# Altium project RT2 - DUT Single Channel for VNA.PrjPcb
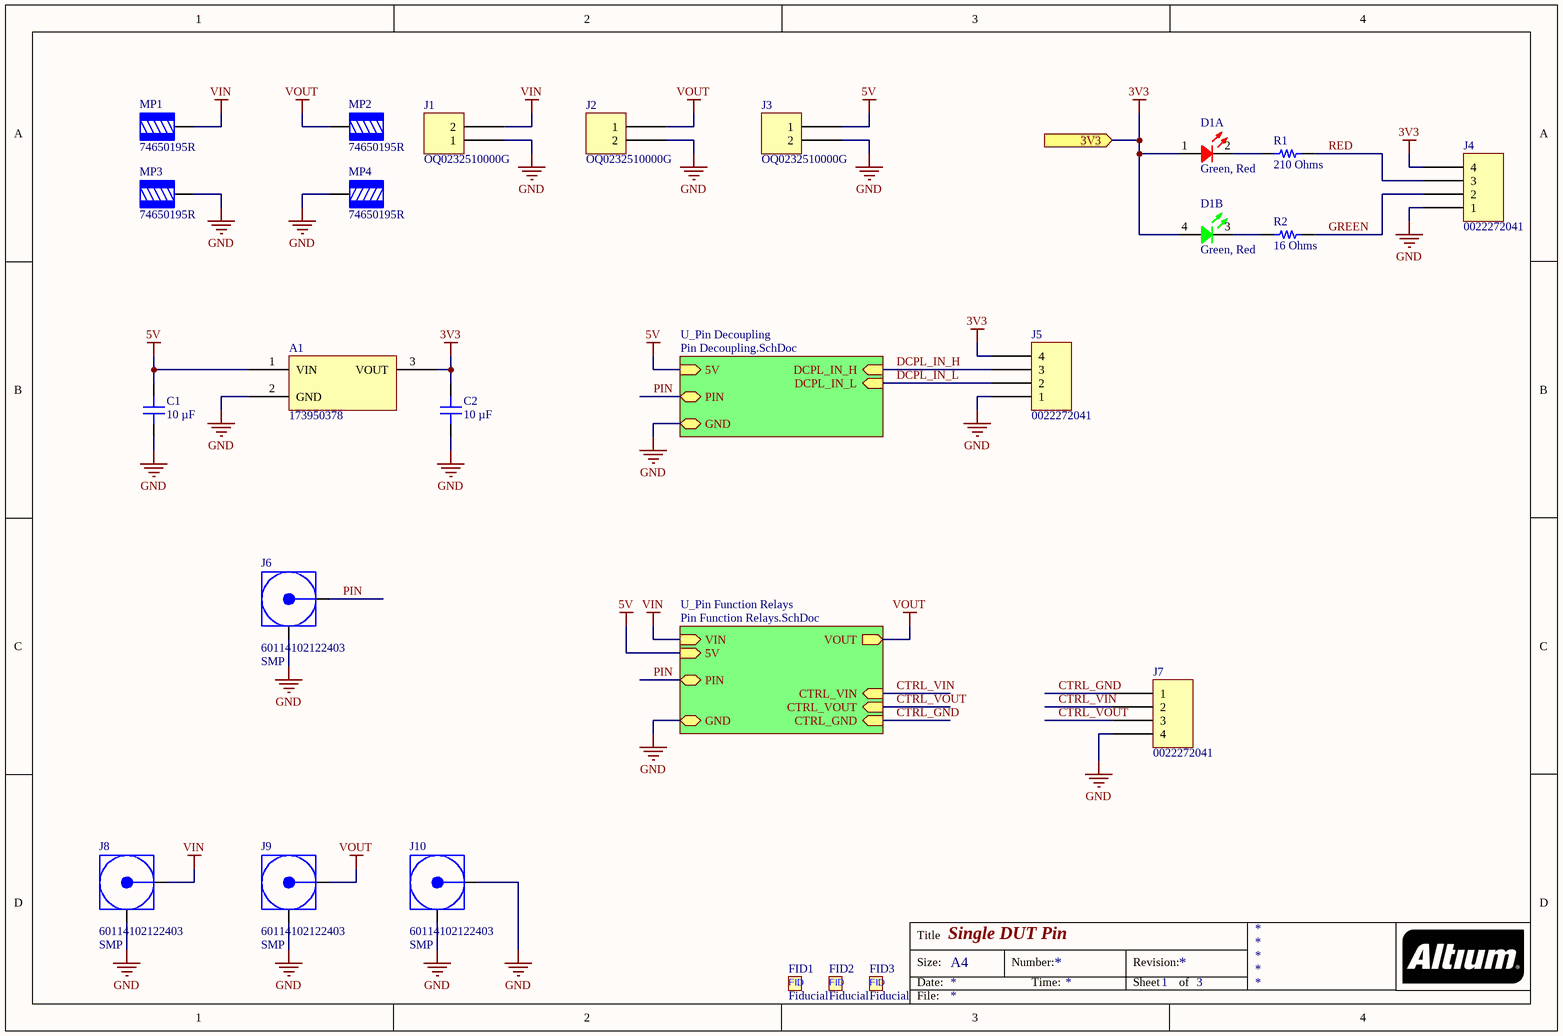
[diagram p0: DUT Pin.SchDoc]
3 sheets, 59 parts. Net scope: hierarchical (ports join the sheet entries above them; power ports are global).
Board file: RT2 DUT Single Pin.PcbDoc
Sheets:
  DUT Pin.SchDoc
    U_Pin Decoupling = Pin Decoupling.SchDoc
    U_Pin Function Relays = Pin Function Relays.SchDoc

## Sheet DUT Pin.SchDoc: Single DUT Pin
size A4; SheetNumber: 1; SheetTotal: 3

### Parts
A1  173950378  [WURTH WPME-FDSM SIP-3 173950x78]
C1  10 µF  [CAP 1206_3216 - 0.8MM]
C2  10 µF  [CAP 1206_3216 - 0.8MM]
D1  Green, Red  [KINGBRIGHT APHBM2012SURKZGKC]  (parts A,B of 2)
FID1  Fiducial  [Fiducial-1mm]  (no BOM)
FID2  Fiducial  [Fiducial-1mm]  (no BOM)
FID3  Fiducial  [Fiducial-1mm]  (no BOM)
J1  OQ0232510000G  [FCI 06-381-2PIN]
J2  OQ0232510000G  [FCI 06-381-2PIN]
J3  OQ0232510000G  [FCI 06-381-2PIN]
J4  0022272041  [MOLEX KK 0022272041]
J5  0022272041  [MOLEX KK 0022272041]
J6  60114102122403  Connector Style: SMP  [WURTH SMP 60114102122403]
J7  0022272041  [MOLEX KK 0022272041]
J8  60114102122403  Connector Style: SMP  [WURTH SMP 60114102122403]
J9  60114102122403  Connector Style: SMP  [WURTH SMP 60114102122403]
J10  60114102122403  Connector Style: SMP  [WURTH SMP 60114102122403]
MP1  74650195R  [WURTH 74650195]
MP2  74650195R  [WURTH 74650195]
MP3  74650195R  [WURTH 74650195]
MP4  74650195R  [WURTH 74650195]
R1  210 Ohms  [RES 0603_1608]
R2  16 Ohms  [RES 0603_1608]

### Sub-sheets
U_Pin Decoupling = Pin Decoupling.SchDoc: 5V (in), GND (bidir), DCPL_IN_H (in), DCPL_IN_L (in), PIN (bidir)
U_Pin Function Relays = Pin Function Relays.SchDoc: PIN (bidir), CTRL_VIN (in), CTRL_VOUT (in), CTRL_GND (in), GND (bidir), VOUT (out), VIN (in), 5V (in)

### Ports
3V3 (in)

### Nets
3V3: A1.3(VOUT) C2.2 D1.1 D1.4 J4.4 J5.4 ; port 3V3
5V: A1.1(VIN) C1.2 J3.1 ; sheet U_Pin Decoupling/5V, sheet U_Pin Function Relays/5V
GND: A1.2(GND) C1.1 C2.1 J1.1 J2.2 J3.2 J4.1 J5.1 J6.G(GND) J7.4 J8.G(GND) J9.G(GND) J10.G(GND) J10.S(Signal) MP3.1 MP4.1 ; sheet U_Pin Decoupling/GND, sheet U_Pin Function Relays/GND
VIN: J1.2 J8.S(Signal) MP1.1 ; sheet U_Pin Function Relays/VIN
VOUT: J2.1 J9.S(Signal) MP2.1 ; sheet U_Pin Function Relays/VOUT
CTRL_GND: J7.1 ; sheet U_Pin Function Relays/CTRL_GND
CTRL_VIN: J7.2 ; sheet U_Pin Function Relays/CTRL_VIN
CTRL_VOUT: J7.3 ; sheet U_Pin Function Relays/CTRL_VOUT
DCPL_IN_H: J5.3 ; sheet U_Pin Decoupling/DCPL_IN_H
DCPL_IN_L: J5.2 ; sheet U_Pin Decoupling/DCPL_IN_L
GREEN: J4.2 R2.2
PIN: J6.S(Signal) ; sheet U_Pin Decoupling/PIN, sheet U_Pin Function Relays/PIN
RED: J4.3 R1.2
NetD1_2: D1.2 R1.1
NetD1_3: D1.3 R2.1

### Notes on the sheet
- Title
- Size:
- Date:
- A4
- Number:
- Time:
- Revision:
- Sheet
- of
- File:
- (in symbol CMP-002-000000-1) FID

### Library data of the parts
A1 = 173950378: DC DC CONVERTER 3.3V 1.65W; Manufacturer: Würth Elektronik; Current - Output (Max): 500mA; Efficiency: 95%; Number of Outputs: 1; Voltage - Input (Max): 28V; Voltage - Input (Min): 6V; Part Number: 173950378; Applications: ITE (Commercial); ComponentLink1Description: Datasheet; ComponentLink1URL: //media.digikey.com/pdf/Data%20Sheets/Wurth%20Electronics%20PDFs/173950378_173950578.pdf; ComponentLink2Description: DigiKey Link; ComponentLink2URL: https://www.digikey.com/en/products/detail/würth-elektronik/173950378/5725366; Features: OTP, OVP, SCP; LastUpdated: 10/08/2022 09:47:10; Lifecycle Status: Active; Minimum Order: 1; Mounting Type: Through Hole; Operating Temperature: -40°C ~ 85°C; Package / Case: 3-SIP Module; Packaging: Tube; PartId: 50; Part Status: Active; Power (Watts): 1.65 W; Price: 4.40; Series: MagI³C (1W); Size / Dimension: 0.46" L x 0.33" W x 0.41" H (11.6mm x 8.5mm x 10.4mm); Supplier 1: DigiKey; Supplier Part Number 1: 732-8242-5-ND; Type: Linear Regulator Replacement; Voltage - Output 1: 3.3V
C1 C2 = CL31B106KAHNNNE: CAP CER 10UF 25V X7R 1206; manufacturer: Samsung Electro-Mechanics; Tolerance: ±10%; Part Number: CL31B106KAHNNNE; Value: 10 µF; Applications: General Purpose; Capacitance: 10 µF; componentlink1description: Datasheet; componentlink1url: http://www.samsungsem.com/kr/support/product-search/mlcc/CL31B106KAHNNNE.jsp; componentlink2description: DigiKey Link; componentlink2url: https://www.digikey.com/en/products/detail/samsung-electro-mechanics/CL31B106KAHNNNE/3887462; Device Package: 1206 (3216 Metric); lastupdated: 12/09/2023 19:14:51; Lifecycle Status: Active; Minimum Order: 1; Mounting Type: Surface Mount, MLCC; Operating Temperature: -55°C ~ 125°C; Package / Case: 1206 (3216 Metric); packaging: TapeAndReel; partid: 40754; Part Status: Active; price: 0.03; series: CL; Size / Dimension: 0.126" L x 0.063" W (3.20mm x 1.60mm); Supplier 1: DigiKey; Supplier Part Number 1: 1276-1804-1-ND; Temperature Coefficient: X7R; Thickness (Max): 0.071" (1.80mm); Voltage - Rated: 25V
D1 = APHBM2012SURKZGKC: LED GREEN/RED CLEAR 4SMD; Manufacturer: Kingbright; Configuration: Independent; Current - Test: 20mA Green, 20mA Red; Lens Color: Colorless; Lens Size: 1.25mm x 1.20mm; Lens Style: Rectangle with Flat Top; Millicandela Rating: 280mcd Green, 250mcd Red; Viewing Angle: 120°; Voltage - Forward (Vf) (Typ): 3.3V Green, 1.95V Red; Wavelength - Dominant: 525nm Green, 630nm Red; Wavelength - Peak: 515nm Green, 645nm Red; Part Number: APHBM2012SURKZGKC; Color: Green, Red; ComponentLink1Description: Datasheet; ComponentLink1URL: http://www.kingbrightusa.com/images/catalog/SPEC/APHBM2012SURKZGKC.pdf; ComponentLink2Description: DigiKey Link; ComponentLink2URL: https://www.digikey.com/en/products/detail/kingbright/APHBM2012SURKZGKC/7318970; Device Package: 0805 (2012 Metric); Height (Max): 0.45mm; LastUpdated: 22/08/2023 14:29:40; Lens Transparency: Clear; Lifecycle Status: Active; Minimum Order: 1; Mounting Type: Surface Mount; Package / Case: 0805 (2012 Metric); Packaging: TapeAndReel; PartId: 1367; Part Status: Active; Price: 0.18; Series: -; Size / Dimension: 2.00mm L x 1.25mm W; Supplier 1: DigiKey; Supplier Part Number 1: 754-2117-1-ND; Supplier Device Package: 4-SMD; Value: Green, Red
FID1-FID3 = CMP-002-000000-1: Design Item ID: Fiducial; Component Type: Standard; Source: Fiducial.SchLib; Pin Count: 0
J1-J3 = OQ0232510000G: TERM BLOCK HDR 2POS 90DEG 3.81MM; Manufacturer: Amphenol Anytek; Current - UL: 10A; Header Orientation: 90°, Right Angle; Number of Levels: 1; Number of Positions: 2; Pitch: 0.150" (3.81mm); Voltage - UL: 300V; Part Number: OQ0232510000G; Color: Green; ComponentLink1Description: Datasheet; ComponentLink1URL: http://portal.fciconnect.com/Comergent//fci/drawing/oqxx32x100j0g.pdf; ComponentLink2Description: DigiKey Link; ComponentLink2URL: //digikey.com/product-detail/en/amphenol-anytek/OQ0232510000G/609-3819-ND/2261255; Contact Mating Finish: Tin; LastUpdated: 16/12/2019 19:14:30; Lifecycle Status: 0; Minimum Order: 1; Mounting Type: Through Hole; Operating Temperature: -40°C ~ 115°C; Packaging: Bulk; Part Status: Active; Positions Per Level: 2; Price: 0.49; Series: 06-381; Supplier 1: DigiKey; Supplier Part Number 1: 609-3819-ND; Termination Style: Solder; Type: Header, Male Pins, Shrouded (4 Side)
J4 J5 J7 = 0022272041: CONN HEADER VERT 4POS 2.54MM; Manufacturer: Molex; Contact Length - Mating: 0.295" (7.49mm); Contact Length - Post: 0.140" (3.56mm); Material Flammability Rating: UL94 V-0; Number of Positions: 4; Number of Positions Loaded: All; Overall Contact Length: 0.560" (14.22mm); Pitch - Mating: 0.100" (2.54mm); Shrouding: Shrouded - 1 Wall; Style: Board to Cable/Wire; Part Number: 0022272041; ComponentLink1Description: Datasheet; ComponentLink1URL: https://www.molex.com/pdm_docs/sd/022272041_sd.pdf; ComponentLink2Description: DigiKey Link; ComponentLink2URL: http://digikey.com/product-detail/en/molex/0022272041/WM4113-ND/1130579; Connector Type: Header; Contact Finish - Mating: Tin; Contact Finish - Post: Tin; Contact Finish Thickness - Mating: 100.0µin (2.54µm); Contact Material: Brass; Contact Shape: Square; Contact Type: Male Pin; Fastening Type: Friction Lock; Insulation Color: Natural; Insulation Height: 0.461" (11.70mm); Insulation Material: Polyamide (PA), Nylon; LastUpdated: 12/01/2020 23:52:05; Lifecycle Status: Active; Minimum Order: 1; Mounting Type: Through Hole; Number of Rows: 1; Packaging: Bulk; PartId: 78; Part Status: Active; Price: 0.40; Series: KK 6410; Supplier 1: DigiKey; Supplier Part Number 1: WM4113-ND; Termination: Solder
J6 J8-J10 = 60114102122403: WR-SMP_PCB CONNECTOR_SMT PLUG; Manufacturer: Würth Elektronik; Connector Type: Plug, Male Pin; Contact Termination: Solder; Frequency - Max: 12 GHz; Impedance: 50Ohm; Number of Ports: 1; Part Number: 60114102122403; ComponentLink1Description: Datasheet; ComponentLink1URL: https://www.we-online.com/katalog/datasheet/60114102122403.pdf; ComponentLink2Description: DigiKey Link; ComponentLink2URL: https://www.digikey.com/en/products/detail/würth-elektronik/60114102122403/12726355; Fastening Type: Snap-On; Features: Smooth Bore; Housing Color: Gold; LastUpdated: 05/09/2023 23:26:06; Lifecycle Status: Active; Minimum Order: 1; Mounting Type: Surface Mount; Packaging: Tray; Part Status: Active; Price: 5.68; Series: WR-SMP; Shield Termination: Solder; Supplier 1: DigiKey; Supplier Part Number 1: 732-60114102122403CT-ND
MP1-MP4 = 74650195R: BUSH, THR CLOSEDM5, BLIND 4.0MM; Manufacturer: Würth Elektronik; Current Rating (Amps): 85A; Screw Size: M5; Part Number: 74650195R; ComponentLink1Description: Datasheet; ComponentLink1URL: https://katalog.we-online.de/em/datasheet/74650195R.pdf; ComponentLink2Description: DigiKey Link; ComponentLink2URL: http://digikey.com/product-detail/en/w-rth-elektronik/74650195R/732-10888-1-ND/6644299; Features: Screw not Included; LastUpdated: 07/08/2022 20:44:44; Lifecycle Status: Active; Minimum Order: 1; Mounting Type: Through Hole; Number of Pins: 9; Packaging: Unknown; Part Status: Active; Price: 3.06; Series: REDCUBE WP-THRBU; Supplier 1: DigiKey; Supplier Part Number 1: 732-10888-1-ND; Terminal Type: Screw Terminal, Power Tap; Termination: Solder
R1 = RC0603FR-07210RL: RES 210 OHM 1% 1/10W 0603; Manufacturer: Yageo; Power (Watts): 0.1W, 1/10W; Temperature Coefficient: ±100ppm/°C; Part Number: RC0603FR-07210RL; Value: 210 Ohms; ComponentLink1Description: Datasheet; ComponentLink1URL: https://www.yageo.com/upload/media/product/productsearch/datasheet/rchip/PYu-RC_Group_51_RoHS_L_10.pdf; ComponentLink2Description: DigiKey Link; ComponentLink2URL: https://www.digikey.com/en/products/detail/yageo/RC0603FR-07210RL/727051; Composition: Thick Film; Device Package: 0603 (1608 Metric); Features: Moisture Resistant; Height - Seated (Max): 0.022" (0.55mm); LastUpdated: 21/08/2023 19:33:43; Lifecycle Status: Active; Minimum Order: 1; Number of Terminations: 2; Operating Temperature: -55°C ~ 155°C; Package / Case: 0603 (1608 Metric); Packaging: CutTape; PartId: 22814; Part Status: Active; Price: 0.01; Resistance: 210 Ohms; Series: RC_L; Size / Dimension: 0.063" L x 0.031" W (1.60mm x 0.80mm); Supplier 1: DigiKey; Supplier Part Number 1: 311-210HRCT-ND; Supplier Device Package: 0603; Tolerance: ±1%
R2 = RC0603FR-0716RL: RES 16 OHM 1% 1/10W 0603; Manufacturer: Yageo; Power (Watts): 0.1W, 1/10W; Temperature Coefficient: ±100ppm/°C; Part Number: RC0603FR-0716RL; Value: 16 Ohms; ComponentLink1Description: Datasheet; ComponentLink1URL: https://www.yageo.com/upload/media/product/productsearch/datasheet/rchip/PYu-RC_Group_51_RoHS_L_10.pdf; ComponentLink2Description: DigiKey Link; ComponentLink2URL: https://www.digikey.com/en/products/detail/yageo/RC0603FR-0716RL/726964; Composition: Thick Film; Device Package: 0603 (1608 Metric); Features: Moisture Resistant; Height - Seated (Max): 0.022" (0.55mm); LastUpdated: 21/08/2023 19:33:43; Lifecycle Status: Active; Minimum Order: 1; Number of Terminations: 2; Operating Temperature: -55°C ~ 155°C; Package / Case: 0603 (1608 Metric); Packaging: CutTape; PartId: 22883; Part Status: Active; Price: 0.01; Resistance: 16 Ohms; Series: RC_L; Size / Dimension: 0.063" L x 0.031" W (1.60mm x 0.80mm); Supplier 1: DigiKey; Supplier Part Number 1: 311-16.0HRCT-ND; Supplier Device Package: 0603; Tolerance: ±1%

## Sheet Pin Decoupling.SchDoc: Pin Decoupling
size A4; SheetNumber: 3; SheetTotal: 3
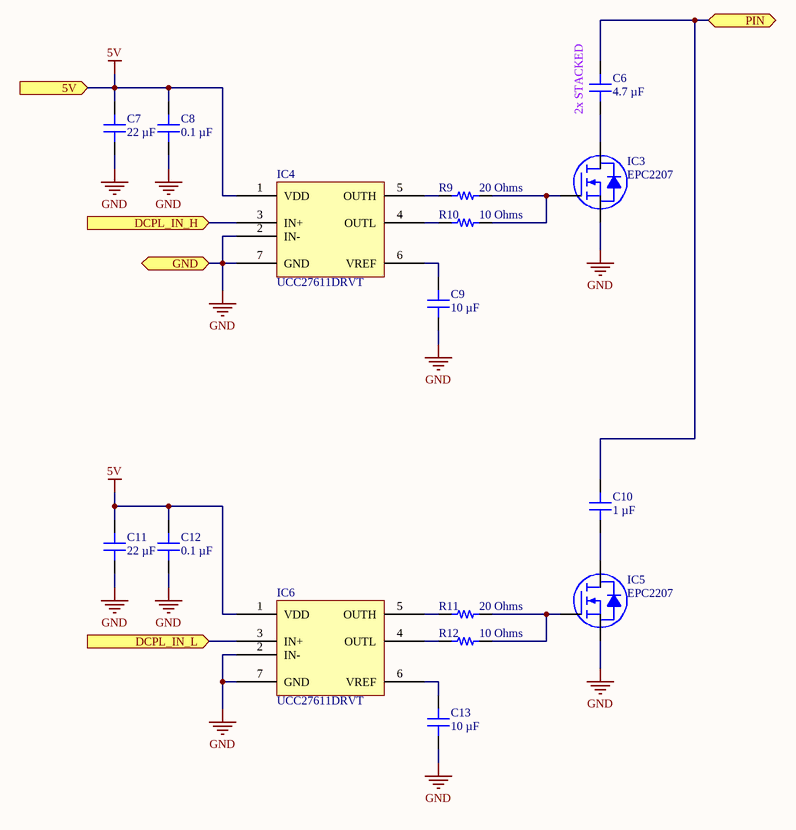
[diagram p1: Pin Decoupling.SchDoc]

### Parts
C6  4.7 µF  [CAP 1206_3216 - 0.8MM]
C7  22 µF  [CAP 0603_1608]
C8  0.1 µF  [CAP 0603_1608]
C9  10 µF  [CAP 0603_1608]
C10  1 µF  [CAP 1206_3216 - 0.8MM]
C11  22 µF  [CAP 0603_1608]
C12  0.1 µF  [CAP 0603_1608]
C13  10 µF  [CAP 0603_1608]
IC3  EPC2207  [EPC EPC2207]
IC4  UCC27611DRVT  [TI WSON-6 DRV0006D 2x2MM]
IC5  EPC2207  [EPC EPC2207]
IC6  UCC27611DRVT  [TI WSON-6 DRV0006D 2x2MM]
R9  20 Ohms  [RES 0603_1608]
R10  10 Ohms  [RES 0603_1608]
R11  20 Ohms  [RES 0603_1608]
R12  10 Ohms  [RES 0603_1608]

### Ports
5V (in, see DUT Pin[2B], Pin Function Relays[1A]), DCPL_IN_H (in, see DUT Pin[3B]), DCPL_IN_L (in, see DUT Pin[3B]), GND (bidir, see DUT Pin[2B], Pin Function Relays[3D]), PIN (bidir, see DUT Pin[2B], Pin Function Relays[3A])

### Nets
5V: C7.2 C8.2 C11.2 C12.2 IC4.1(VDD) IC6.1(VDD) ; port 5V
GND: C7.1 C8.1 C9.1 C11.1 C12.1 C13.1 IC3.S IC4.2(IN-) IC4.7(GND) IC5.S IC6.2(IN-) IC6.7(GND) ; port GND
DCPL_IN_H: IC4.3(IN+) ; port DCPL_IN_H
DCPL_IN_L: IC6.3(IN+) ; port DCPL_IN_L
PIN: C6.2 C10.2 ; port PIN
NetC6_1: C6.1 IC3.D
NetC9_2: C9.2 IC4.6(VREF)
NetC10_1: C10.1 IC5.D
NetC13_2: C13.2 IC6.6(VREF)
NetIC3_G: IC3.G R9.2 R10.2
NetIC4_4: IC4.4(OUTL) R10.1
NetIC4_5: IC4.5(OUTH) R9.1
NetIC5_G: IC5.G R11.2 R12.2
NetIC6_4: IC6.4(OUTL) R12.1
NetIC6_5: IC6.5(OUTH) R11.1

### Notes on the sheet
- (near C6) 2x STACKED
- Title
- Size:
- Date:
- A4
- Number:
- Time:
- Revision:
- Sheet
- of
- File:

### Library data of the parts
C6 = GRJ31CZ72A475KE01L: CAP CER 4.7UF 100V X7R 1206; manufacturer: Murata Electronics; Tolerance: ±10%; Part Number: GRJ31CZ72A475KE01L; Value: 4.7 µF; Applications: Boardflex Sensitive; Capacitance: 4.7 µF; componentlink1description: Datasheet; componentlink1url: https://search.murata.co.jp/Ceramy/image/img/A01X/G101/ENG/GRJ31CZ72A475KE01-01.pdf; componentlink2description: DigiKey Link; componentlink2url: https://www.digikey.com/en/products/detail/murata-electronics/GRJ31CZ72A475KE01L/16033704; Device Package: 1206 (3216 Metric); Features: Soft Termination; lastupdated: 20/08/2023 19:15:38; Lifecycle Status: Active; Minimum Order: 1; Mounting Type: Surface Mount, MLCC; Operating Temperature: -55°C ~ 125°C; Package / Case: 1206 (3216 Metric); packaging: TapeAndReel; partid: 42915; Part Status: Active; price: 0.20; series: GRJ; Size / Dimension: 0.126" L x 0.063" W (3.20mm x 1.60mm); Supplier 1: DigiKey; Supplier Part Number 1: 490-GRJ31CZ72A475KE01LCT-ND; Temperature Coefficient: X7R; Thickness (Max): 0.075" (1.90mm); Voltage - Rated: 100V
C7 C11 = ZRB18AR61A226ME01L: CAP CER 22UF 10V X5R 0603; manufacturer: Murata Electronics; Tolerance: ±20%; Part Number: ZRB18AR61A226ME01L; Value: 22 µF; Applications: Acoustic Noise Reduction; Capacitance: 22 µF; componentlink1description: Datasheet; componentlink1url: https://search.murata.co.jp/Ceramy/image/img/A01X/G101/ENG/ZRB18AR61A226ME01-02.pdf; componentlink2description: DigiKey Link; componentlink2url: https://www.digikey.com/en/products/detail/murata-electronics/ZRB18AR61A226ME01L/7243452; Device Package: 0603 (1608 Metric); Features: Interposer Termination; lastupdated: 20/08/2023 19:08:34; Lifecycle Status: Active; Minimum Order: 1; Mounting Type: Surface Mount, MLCC; Operating Temperature: -55°C ~ 85°C; Package / Case: 0603 (1608 Metric); packaging: TapeAndReel; partid: 34379; Part Status: Active; price: 0.05; series: ZRB; Size / Dimension: 0.063" L x 0.031" W (1.60mm x 0.80mm); Supplier 1: DigiKey; Supplier Part Number 1: 490-ZRB18AR61A226ME01LCT-ND; Temperature Coefficient: X5R; Thickness (Max): 0.047" (1.20mm); Voltage - Rated: 10V
C8 C12 = CL10B104KB8NNNC: CAP CER 0.1UF 50V X7R 0603; manufacturer: Samsung Electro-Mechanics; Tolerance: ±10%; Part Number: CL10B104KB8NNNC; Value: 0.1 µF; Applications: General Purpose; Capacitance: 0.1 µF; componentlink1description: Datasheet; componentlink1url: http://www.samsungsem.com/kr/support/product-search/mlcc/CL10B104KB8NNNC.jsp; componentlink2description: DigiKey Link; componentlink2url: https://www.digikey.com/en/products/detail/samsung-electro-mechanics/CL10B104KB8NNNC/3886658; Device Package: 0603 (1608 Metric); lastupdated: 20/08/2023 19:09:00; Lifecycle Status: Active; Minimum Order: 1; Mounting Type: Surface Mount, MLCC; Operating Temperature: -55°C ~ 125°C; Package / Case: 0603 (1608 Metric); packaging: TapeAndReel; partid: 9788; Part Status: Active; price: 0.01; series: CL; Size / Dimension: 0.063" L x 0.031" W (1.60mm x 0.80mm); Supplier 1: DigiKey; Supplier Part Number 1: 1276-1000-1-ND; Temperature Coefficient: X7R; Thickness (Max): 0.035" (0.90mm); Voltage - Rated: 50V
C9 C13 = GRM188R61A106ME69J: CAP CER 10UF 10V X5R 0603; manufacturer: Murata Electronics; Tolerance: ±20%; Part Number: GRM188R61A106ME69J; Value: 10 µF; Applications: General Purpose; Capacitance: 10 µF; componentlink2description: DigiKey Link; componentlink2url: https://www.digikey.com/en/products/detail/murata-electronics/GRM188R61A106ME69J/10695932; Device Package: 0603 (1608 Metric); lastupdated: 20/08/2023 19:07:38; Lifecycle Status: Active; Minimum Order: 1; Mounting Type: Surface Mount, MLCC; Operating Temperature: -55°C ~ 85°C; Package / Case: 0603 (1608 Metric); packaging: TapeAndReel; partid: 54715; Part Status: Active; price: 0.01; series: GRM; Size / Dimension: 0.063" L x 0.032" W (1.60mm x 0.80mm); Supplier 1: DigiKey; Supplier Part Number 1: 490-GRM188R61A106ME69JCT-ND; Temperature Coefficient: X5R; Thickness (Max): 0.037" (0.95mm); Voltage - Rated: 10V
C10 = GCJ31CR72A105KA01L: CAP CER 1UF 100V X7R 1206; manufacturer: Murata Electronics; Tolerance: ±10%; Part Number: GCJ31CR72A105KA01L; Value: 1 µF; Applications: Automotive, Boardflex Sensitive; Capacitance: 1 µF; componentlink1description: Datasheet; componentlink1url: https://search.murata.co.jp/Ceramy/image/img/A01X/G101/ENG/GCJ31CR72A105KA01-01.pdf; componentlink2description: DigiKey Link; componentlink2url: https://www.digikey.com/en/products/detail/murata-electronics/GCJ31CR72A105KA01L/7363212; Device Package: 1206 (3216 Metric); Features: Soft Termination; lastupdated: 20/08/2023 19:16:17; Lifecycle Status: Active; Minimum Order: 1; Mounting Type: Surface Mount, MLCC; Operating Temperature: -55°C ~ 125°C; Package / Case: 1206 (3216 Metric); packaging: TapeAndReel; partid: 44338; Part Status: Active; price: 0.11; Ratings: AEC-Q200; series: GCJ; Size / Dimension: 0.126" L x 0.063" W (3.20mm x 1.60mm); Supplier 1: DigiKey; Supplier Part Number 1: 490-16468-1-ND; Temperature Coefficient: X7R; Thickness (Max): 0.075" (1.90mm); Voltage - Rated: 100V
IC3 IC5 = EPC2207: TRANS GAN 200V DIE .022OHM; Manufacturer: EPC; Current - Continuous Drain (Id) @ 25°C: 14A (Ta); Drive Voltage (Max Rds On,  Min Rds On): 5V; FET Type: N-Channel; Gate Charge (Qg) (Max) @ Vgs: 5.9 nC @ 5 V; Input Capacitance (Ciss) (Max) @ Vds: 600 pF @ 100 V; Rds On (Max) @ Id, Vgs: 22mOhm @ 14A, 5V; Vgs (Max): +6V, -4V; Vgs(th) (Max) @ Id: 2.5V @ 2mA; Part Number: EPC2207; ComponentLink1Description: Datasheet; ComponentLink1URL: https://epc-co.com/epc/Portals/0/epc/documents/datasheets/EPC2207_datasheet.pdf; ComponentLink2Description: DigiKey Link; ComponentLink2URL: https://www.digikey.com/en/products/detail/epc/EPC2207/12821510; Drain to Source Voltage (Vdss): 200 V; LastUpdated: 21/08/2023 03:24:17; Lifecycle Status: Active; Minimum Order: 1; Mounting Type: Surface Mount; Operating Temperature: -40°C ~ 150°C (TJ); Packaging: TapeAndReel; Part Status: Active; Price: 1.45; Series: -; Supplier 1: DigiKey; Supplier Part Number 1: 917-EPC2207CT-ND; Supplier Device Package: Die; Technology: GaNFET (Gallium Nitride)
IC4 IC6 = UCC27611DRVT: IC GATE DRVR LOW-SIDE 6WSON; Manufacturer: Texas Instruments; Channel Type: Single; Current - Peak Output (Source, Sink): 4A, 6A; Gate Type: N-Channel MOSFET; Input Type: Inverting, Non-Inverting; Logic Voltage - VIL, VIH: 1.3V, 1.85V; Number of Drivers: 1; Rise / Fall Time (Typ): 5ns, 5ns; Voltage - Supply: 4V ~ 18V; Part Number: UCC27611DRVT; ComponentLink1Description: Datasheet; ComponentLink1URL: http://www.ti.com/general/docs/suppproductinfo.tsp?distId=10&gotoUrl=http%3A%2F%2Fwww.ti.com%2Flit%2Fgpn%2Fucc27611; ComponentLink2Description: DigiKey Link; ComponentLink2URL: https://www.digikey.com/en/products/detail/texas-instruments/UCC27611DRVT/3871279; Driven Configuration: Low-Side; LastUpdated: 21/08/2023 01:53:28; Lifecycle Status: Active; Minimum Order: 1; Mounting Type: Surface Mount; Operating Temperature: -40°C ~ 140°C (TJ); Package / Case: 6-WDFN Exposed Pad; Packaging: TapeAndReel; PartId: 28; Part Status: Active; Price: 1.10; Series: -; Supplier 1: DigiKey; Supplier Part Number 1: 296-35639-1-ND; Supplier Device Package: 6-WSON (2x2)
R9 R11 = ERJ-3EKF20R0V: RES SMD 20 OHM 1% 1/10W 0603; Manufacturer: Panasonic Electronic Components; Power (Watts): 0.1W, 1/10W; Temperature Coefficient: ±100ppm/°C; Part Number: ERJ-3EKF20R0V; Value: 20 Ohms; ComponentLink1Description: Datasheet; ComponentLink1URL: https://industrial.panasonic.com/cdbs/www-data/pdf/RDA0000/AOA0000C304.pdf; ComponentLink2Description: DigiKey Link; ComponentLink2URL: https://www.digikey.com/en/products/detail/panasonic-electronic-components/ERJ-3EKF20R0V/196201; Composition: Thick Film; Device Package: 0603 (1608 Metric); Features: Automotive AEC-Q200; Height - Seated (Max): 0.022" (0.55mm); LastUpdated: 20/08/2023 19:34:39; Lifecycle Status: Active; Minimum Order: 1; Number of Terminations: 2; Operating Temperature: -55°C ~ 155°C; Package / Case: 0603 (1608 Metric); Packaging: TapeAndReel; PartId: 23067; Part Status: Active; Price: 0.01; Ratings: AEC-Q200; Resistance: 20 Ohms; Series: ERJ-3EK; Size / Dimension: 0.063" L x 0.031" W (1.60mm x 0.80mm); Supplier 1: DigiKey; Supplier Part Number 1: P20.0HCT-ND; Supplier Device Package: 0603; Tolerance: ±1%
R10 R12 = ERJ-3EKF10R0V: RES SMD 10 OHM 1% 1/10W 0603; Manufacturer: Panasonic Electronic Components; Power (Watts): 0.1W, 1/10W; Temperature Coefficient: ±100ppm/°C; Part Number: ERJ-3EKF10R0V; Value: 10 Ohms; ComponentLink1Description: Datasheet; ComponentLink1URL: https://industrial.panasonic.com/cdbs/www-data/pdf/RDA0000/AOA0000C304.pdf; ComponentLink2Description: DigiKey Link; ComponentLink2URL: https://www.digikey.com/en/products/detail/panasonic-electronic-components/ERJ-3EKF10R0V/196065; Composition: Thick Film; Device Package: 0603 (1608 Metric); Features: Automotive AEC-Q200; Height - Seated (Max): 0.022" (0.55mm); LastUpdated: 20/08/2023 19:35:53; Lifecycle Status: Active; Minimum Order: 1; Number of Terminations: 2; Operating Temperature: -55°C ~ 155°C; Package / Case: 0603 (1608 Metric); Packaging: TapeAndReel; PartId: 5647; Part Status: Active; Price: 0.01; Ratings: AEC-Q200; Resistance: 10 Ohms; Series: ERJ-3EK; Size / Dimension: 0.063" L x 0.031" W (1.60mm x 0.80mm); Supplier 1: DigiKey; Supplier Part Number 1: P10.0HCT-ND; Supplier Device Package: 0603; Tolerance: ±1%

## Sheet Pin Function Relays.SchDoc: Pin Function Relays
size A4; SheetNumber: 2; SheetTotal: 3
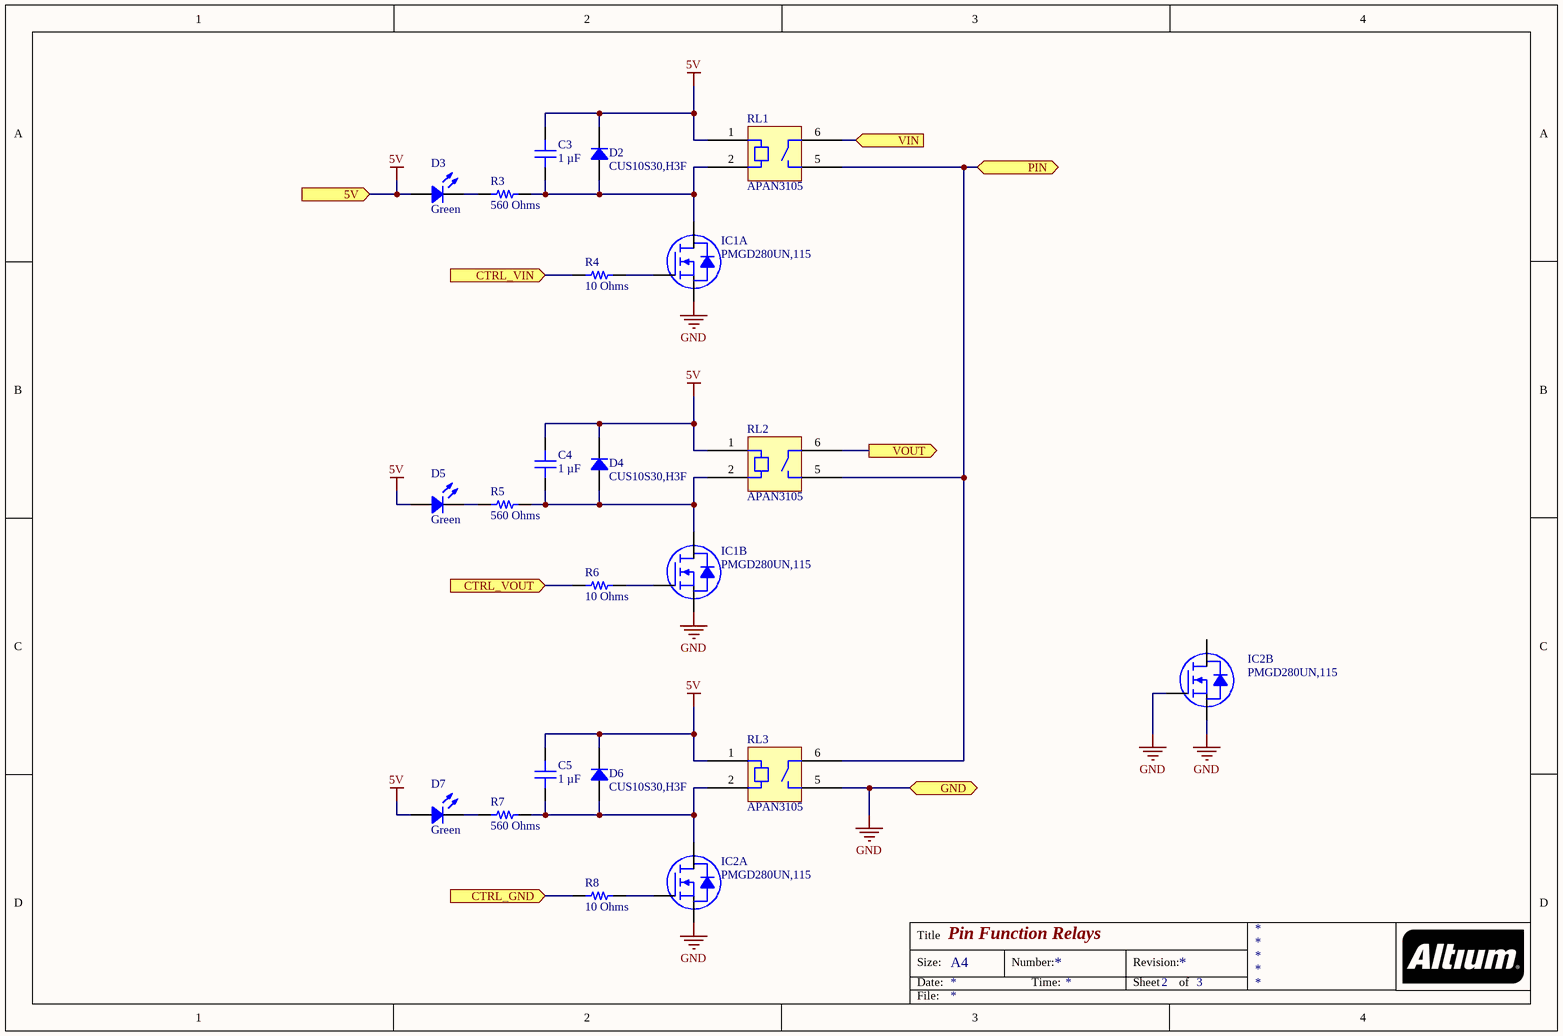
[diagram p2: Pin Function Relays.SchDoc]

### Parts
C3  1 µF  [CAP 0603_1608]
C4  1 µF  [CAP 0603_1608]
C5  1 µF  [CAP 0603_1608]
D2  CUS10S30,H3F  [SOD323]
D3  Green  [LED 0603_1608 GREEN]
D4  CUS10S30,H3F  [SOD323]
D5  Green  [LED 0603_1608 GREEN]
D6  CUS10S30,H3F  [SOD323]
D7  Green  [LED 0603_1608 GREEN]
IC1  PMGD280UN,115  [NXP SOT-363]  (parts A,B of 2)
IC2  PMGD280UN,115  [NXP SOT-363]  (parts A,B of 2)
R3  560 Ohms  [RES 0603_1608]
R4  10 Ohms  [RES 0603_1608]
R5  560 Ohms  [RES 0603_1608]
R6  10 Ohms  [RES 0603_1608]
R7  560 Ohms  [RES 0603_1608]
R8  10 Ohms  [RES 0603_1608]
RL1  APAN3105  [PANASONIC APAN31nn PA-N]
RL2  APAN3105  [PANASONIC APAN31nn PA-N]
RL3  APAN3105  [PANASONIC APAN31nn PA-N]

### Ports
5V (in, see DUT Pin[2C], Pin Decoupling[2A]), CTRL_GND (in, see DUT Pin[3C]), CTRL_VIN (in, see DUT Pin[3C]), CTRL_VOUT (in, see DUT Pin[3C]), GND (bidir, see DUT Pin[2C], Pin Decoupling[2B]), PIN (bidir, see DUT Pin[2C], Pin Decoupling[3A]), VIN (in, see DUT Pin[2C]), VOUT (out, see DUT Pin[3C])

### Nets
5V: C3.2 C4.2 C5.2 D2.2 D3.1 D4.2 D5.1 D6.2 D7.1 RL1.1(COIL1) RL2.1(COIL1) RL3.1(COIL1) ; port 5V
GND: IC1.1(S1) IC1.4(S2) IC2.1(S1) IC2.4(S2) IC2.5(G2) RL3.5(TERM1) ; port GND
VIN: RL1.6(TERM2) ; port VIN
VOUT: RL2.6(TERM2) ; port VOUT
CTRL_GND: R8.1 ; port CTRL_GND
CTRL_VIN: R4.1 ; port CTRL_VIN
CTRL_VOUT: R6.1 ; port CTRL_VOUT
PIN: RL1.5(TERM1) RL2.5(TERM1) RL3.6(TERM2) ; port PIN
NetC3_1: C3.1 D2.1 IC1.6(D1) R3.2 RL1.2(COIL2)
NetC4_1: C4.1 D4.1 IC1.3(D2) R5.2 RL2.2(COIL2)
NetC5_1: C5.1 D6.1 IC2.6(D1) R7.2 RL3.2(COIL2)
NetD3_2: D3.2 R3.1
NetD5_2: D5.2 R5.1
NetD7_2: D7.2 R7.1
NetIC1_2: IC1.2(G1) R4.2
NetIC1_5: IC1.5(G2) R6.2
NetIC2_2: IC2.2(G1) R8.2

Not connected (* = marked no-connect by the designer): IC2 3(D2)

### Notes on the sheet
- Title
- Size:
- Date:
- A4
- Number:
- Time:
- Revision:
- Sheet
- of
- File:

### Library data of the parts
C3-C5 = GCM188R71E105KA64D: CAP CER 1UF 25V X7R 0603; manufacturer: Murata Electronics; Tolerance: ±10%; Part Number: GCM188R71E105KA64D; Value: 1 µF; Applications: Automotive; Capacitance: 1 µF; componentlink1description: Datasheet; componentlink1url: https://www.murata.com/~/media/webrenewal/support/library/catalog/products/capacitor/mlcc/c03e.ashx?la=en-us; componentlink2description: DigiKey Link; componentlink2url: https://www.digikey.com/en/products/detail/murata-electronics/GCM188R71E105KA64D/4903956; Device Package: 0603 (1608 Metric); lastupdated: 20/08/2023 19:09:04; Lifecycle Status: Active; Minimum Order: 1; Mounting Type: Surface Mount, MLCC; Operating Temperature: -55°C ~ 125°C; Package / Case: 0603 (1608 Metric); packaging: TapeAndReel; partid: 6762; Part Status: Active; price: 0.03; Ratings: AEC-Q200; series: GCM; Size / Dimension: 0.063" L x 0.031" W (1.60mm x 0.80mm); Supplier 1: DigiKey; Supplier Part Number 1: 490-10673-1-ND; Temperature Coefficient: X7R; Thickness (Max): 0.035" (0.90mm); Voltage - Rated: 25V
D2 D4 D6 = CUS10S30,H3F: DIODE SCHOTTKY 30V 1A USC; Manufacturer: Toshiba Semiconductor and Storage; Capacitance @ Vr, F: 135pF @ 0V, 1MHz; Current - Reverse Leakage @ Vr: 500 µA @ 30 V; Speed: Fast Recovery =< 500ns, > 200mA (Io); Voltage - Forward (Vf) (Max) @ If: 230 mV @ 100 mA; Part Number: CUS10S30,H3F; ComponentLink1Description: Datasheet; ComponentLink1URL: https://toshiba.semicon-storage.com/info/docget.jsp?did=14077&prodName=CUS10S30; ComponentLink2Description: DigiKey Link; ComponentLink2URL: https://www.digikey.com/en/products/detail/toshiba-semiconductor-and-storage/CUS10S30-H3F/5114299; Current - Average Rectified (Io): 1A; Diode Type: Schottky; LastUpdated: 20/08/2023 20:43:26; Lifecycle Status: Active; Minimum Order: 1; Mounting Type: Surface Mount; Operating Temperature - Junction: 125°C (Max); Package / Case: SC-76, SOD-323; Packaging: TapeAndReel; PartId: 3067; Part Status: Active; Price: 0.05; Series: -; Supplier 1: DigiKey; Supplier Part Number 1: CUS10S30H3FCT-ND; Supplier Device Package: USC; Voltage - DC Reverse (Vr) (Max): 30 V
D3 D5 D7 = SML-LX0603GW-TR: LED GREEN DIFFUSED SMD; Manufacturer: Lumex Opto/Components Inc.; Configuration: Standard; Current - Test: 20mA; Lens Color: White; Lens Size: 1.00mm x 0.80mm; Lens Style: Rectangle with Flat Top; Millicandela Rating: 18mcd; Viewing Angle: 160°; Voltage - Forward (Vf) (Typ): 2.2V; Wavelength - Peak: 565nm; Part Number: SML-LX0603GW-TR; Color: Green; ComponentLink1Description: Datasheet; ComponentLink1URL: https://www.lumex.com/content/files/ProductAttachment/SML-LX0603GW-TR.pdf; ComponentLink2Description: DigiKey Link; ComponentLink2URL: https://www.digikey.com/en/products/detail/lumex-opto-components-inc/SML-LX0603GW-TR/304359; Device Package: 0603 (1608 Metric); Height (Max): 0.60mm; LastUpdated: 20/08/2023 20:23:28; Lens Transparency: Diffused; Lifecycle Status: Active; Minimum Order: 1; Mounting Type: Surface Mount; Package / Case: 0603 (1608 Metric); Packaging: TapeAndReel; PartId: 665; Part Status: Active; Price: 0.05; Series: -; Size / Dimension: 1.60mm L x 0.80mm W; Supplier 1: DigiKey; Supplier Part Number 1: 67-1549-1-ND; Value: Green
IC1 IC2 = PMGD280UN,115: MOSFET 2N-CH 20V 0.87A 6TSSOP; Manufacturer: Nexperia USA Inc.; Current - Continuous Drain (Id) @ 25°C: 870mA; FET Feature: Logic Level Gate; FET Type: 2 N-Channel (Dual); Gate Charge (Qg) (Max) @ Vgs: 0.89nC @ 4.5V; Input Capacitance (Ciss) (Max) @ Vds: 45pF @ 20V; Power - Max: 400mW; Rds On (Max) @ Id, Vgs: 340mOhm @ 200mA, 4.5V; Vgs(th) (Max) @ Id: 1V @ 250µA; Part Number: PMGD280UN,115; ComponentLink1Description: Datasheet; ComponentLink1URL: https://assets.nexperia.com/documents/data-sheet/PMGD280UN.pdf; ComponentLink2Description: DigiKey Link; ComponentLink2URL: http://digikey.com/product-detail/en/nexperia-usa-inc/PMGD280UN115/1727-3125-1-ND/949700; Drain to Source Voltage (Vdss): 20V; LastUpdated: 20/08/2023 20:47:11; Lifecycle Status: Active; Minimum Order: 1; Mounting Type: Surface Mount; Operating Temperature: -55°C ~ 150°C (TJ); Package / Case: 6-TSSOP, SC-88, SOT-363; Packaging: TapeAndReel; Part Status: Active; Price: 0.09; Series: TrenchMOS™; Supplier 1: DigiKey; Supplier Part Number 1: 1727-3125-1-ND; Supplier Device Package: 6-TSSOP
R3 R5 R7 = RC0603FR-07560RL: RES 560 OHM 1% 1/10W 0603; Manufacturer: Yageo; Power (Watts): 0.1W, 1/10W; Temperature Coefficient: ±100ppm/°C; Part Number: RC0603FR-07560RL; Value: 560 Ohms; ComponentLink1Description: Datasheet; ComponentLink1URL: https://www.yageo.com/upload/media/product/productsearch/datasheet/rchip/PYu-RC_Group_51_RoHS_L_10.pdf; ComponentLink2Description: DigiKey Link; ComponentLink2URL: https://www.digikey.com/en/products/detail/yageo/RC0603FR-07560RL/727304; Composition: Thick Film; Device Package: 0603 (1608 Metric); Features: Moisture Resistant; Height - Seated (Max): 0.022" (0.55mm); LastUpdated: 20/08/2023 19:34:59; Lifecycle Status: Active; Minimum Order: 1; Number of Terminations: 2; Operating Temperature: -55°C ~ 155°C; Package / Case: 0603 (1608 Metric); Packaging: CutTape; PartId: 18972; Part Status: Active; Price: 0.01; Resistance: 560 Ohms; Series: RC_L; Size / Dimension: 0.063" L x 0.031" W (1.60mm x 0.80mm); Supplier 1: DigiKey; Supplier Part Number 1: 311-560HRCT-ND; Supplier Device Package: 0603; Tolerance: ±1%
R4 R6 R8 = RC0603FR-0710RL: RES 10 OHM 1% 1/10W 0603; Manufacturer: Yageo; Power (Watts): 0.1W, 1/10W; Temperature Coefficient: ±200ppm/°C; Part Number: RC0603FR-0710RL; Value: 10 Ohms; ComponentLink1Description: Datasheet; ComponentLink1URL: https://www.yageo.com/upload/media/product/productsearch/datasheet/rchip/PYu-RC_Group_51_RoHS_L_10.pdf; ComponentLink2Description: DigiKey Link; ComponentLink2URL: https://www.digikey.com/en/products/detail/yageo/RC0603FR-0710RL/726879; Composition: Thick Film; Device Package: 0603 (1608 Metric); Features: Moisture Resistant; Height - Seated (Max): 0.022" (0.55mm); LastUpdated: 20/08/2023 19:34:43; Lifecycle Status: Active; Minimum Order: 1; Number of Terminations: 2; Operating Temperature: -55°C ~ 155°C; Package / Case: 0603 (1608 Metric); Packaging: TapeAndReel; PartId: 22607; Part Status: Active; Price: 0.01; Resistance: 10 Ohms; Series: RC_L; Size / Dimension: 0.063" L x 0.031" W (1.60mm x 0.80mm); Supplier 1: DigiKey; Supplier Part Number 1: 311-10.0HRCT-ND; Supplier Device Package: 0603; Tolerance: ±1%
RL1-RL3 = APAN3105: RELAY GENERAL PURPOSE SPST 5A 5V; Manufacturer: Panasonic Electric Works; Coil Current: 22mA; Coil Type: Non Latching; Coil Voltage: 5VDC; Contact Form: SPST-NO (1 Form A); Must Operate Voltage: 3.5 VDC; Must Release Voltage: 0.25 VDC; Operate Time: 10ms; Release Time: 5ms; Seal Rating: Sealed - Fully; Switching Voltage: 250VAC, 110VDC - Max; Part Number: APAN3105; ComponentLink1Description: Datasheet; ComponentLink1URL: //media.digikey.com/pdf/Data%20Sheets/Panasonic%20Electric%20Works%20PDFs/PA-N_Series.pdf; ComponentLink2Description: DigiKey Link; ComponentLink2URL: http://digikey.com/product-detail/en/panasonic-electric-works/APAN3105/255-5324-5-ND/6009007; Contact Material: Silver Nickel (AgNi), Gold (Au); Contact Rating (Current): 5A; LastUpdated: 16/08/2023 16:44:09; Lifecycle Status: Active; Minimum Order: 1; Mounting Type: Through Hole; Operating Temperature: -40°C ~ 90°C; Packaging: Tube; Part Status: Active; Price: 5.50; Relay Type: General Purpose; Series: PA-N; Supplier 1: DigiKey; Supplier Part Number 1: 255-5324-5-ND; Termination Style: PC Pin

## Nets that join several sheets
5V: DUT Pin (A1.1 C1.2 J3.1), Pin Decoupling (6 pins), Pin Function Relays (12 pins)
GND: DUT Pin (16 pins), Pin Decoupling (12 pins), Pin Function Relays (6 pins)
VIN: DUT Pin (J1.2 J8.S MP1.1), Pin Function Relays (RL1.6)
VOUT: DUT Pin (J2.1 J9.S MP2.1), Pin Function Relays (RL2.6)
CTRL_GND: DUT Pin (J7.1), Pin Function Relays (R8.1)
CTRL_VIN: DUT Pin (J7.2), Pin Function Relays (R4.1)
CTRL_VOUT: DUT Pin (J7.3), Pin Function Relays (R6.1)
DCPL_IN_H: DUT Pin (J5.3), Pin Decoupling (IC4.3)
DCPL_IN_L: DUT Pin (J5.2), Pin Decoupling (IC6.3)
PIN: DUT Pin (J6.S), Pin Decoupling (C6.2 C10.2), Pin Function Relays (RL1.5 RL2.5 RL3.6)